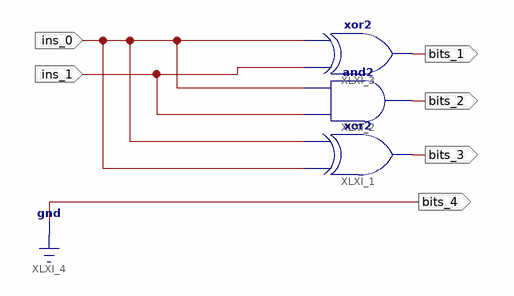
[diagram p0: schematic sheet 1]
// Xilinx ISE schematic encode.sch (spartan6) as structural Verilog: 3 symbols, 6 ports
module encode (
  input  ins_0,
  input  ins_1,
  output bits_1,
  output bits_2,
  output bits_3,
  output bits_4
);

  xor XLXI_1 (bits_3, ins_0, ins_0);
  and XLXI_2 (bits_2, ins_1, ins_0);
  xor XLXI_3 (bits_1, ins_1, ins_0);

  assign bits_4 = 1'b0;
endmodule
